# EAGLE schematic LinuxBoard_v1.91 (EAGLE 7.2.0)
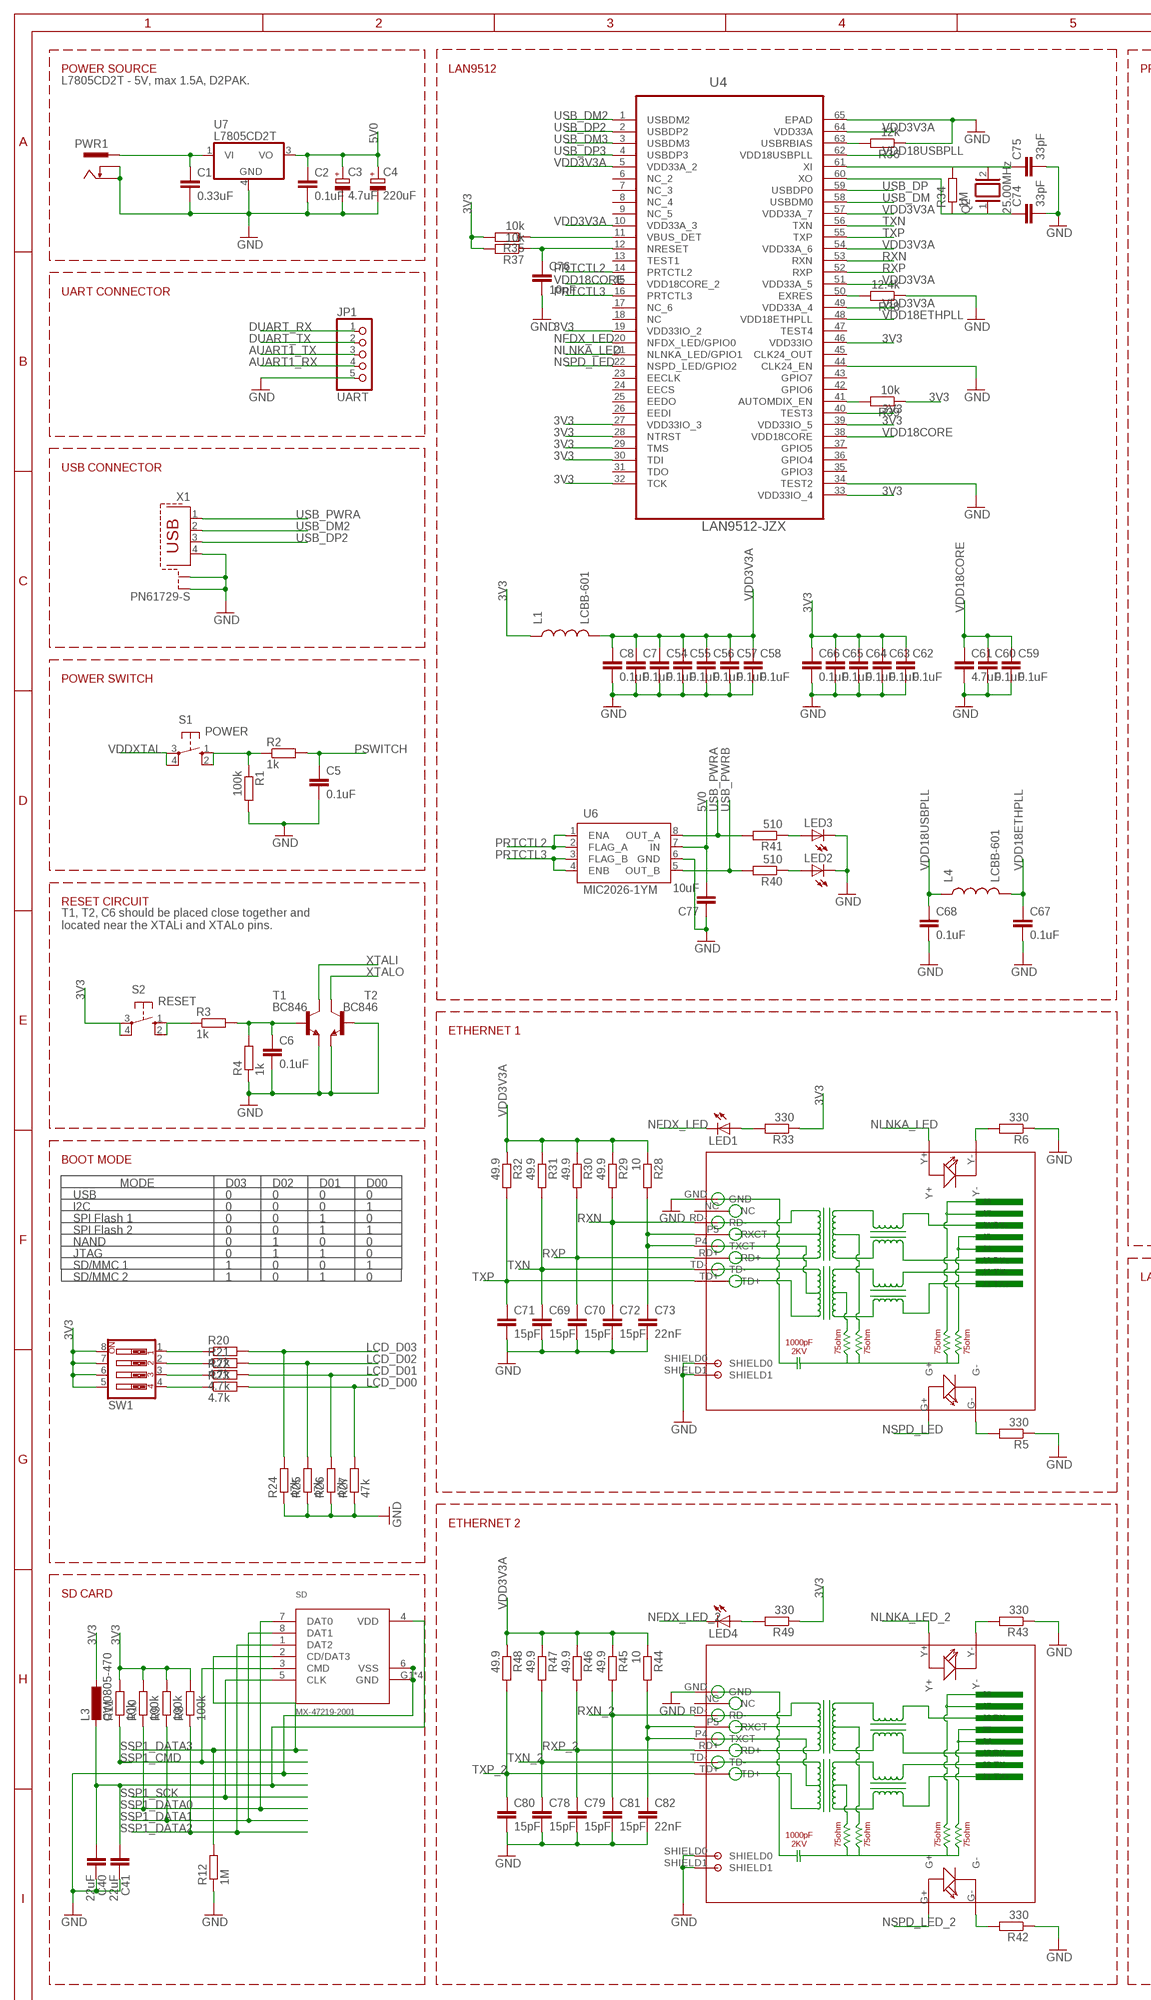
[diagram p0: schematic, sheet 1, part 1 of 2]
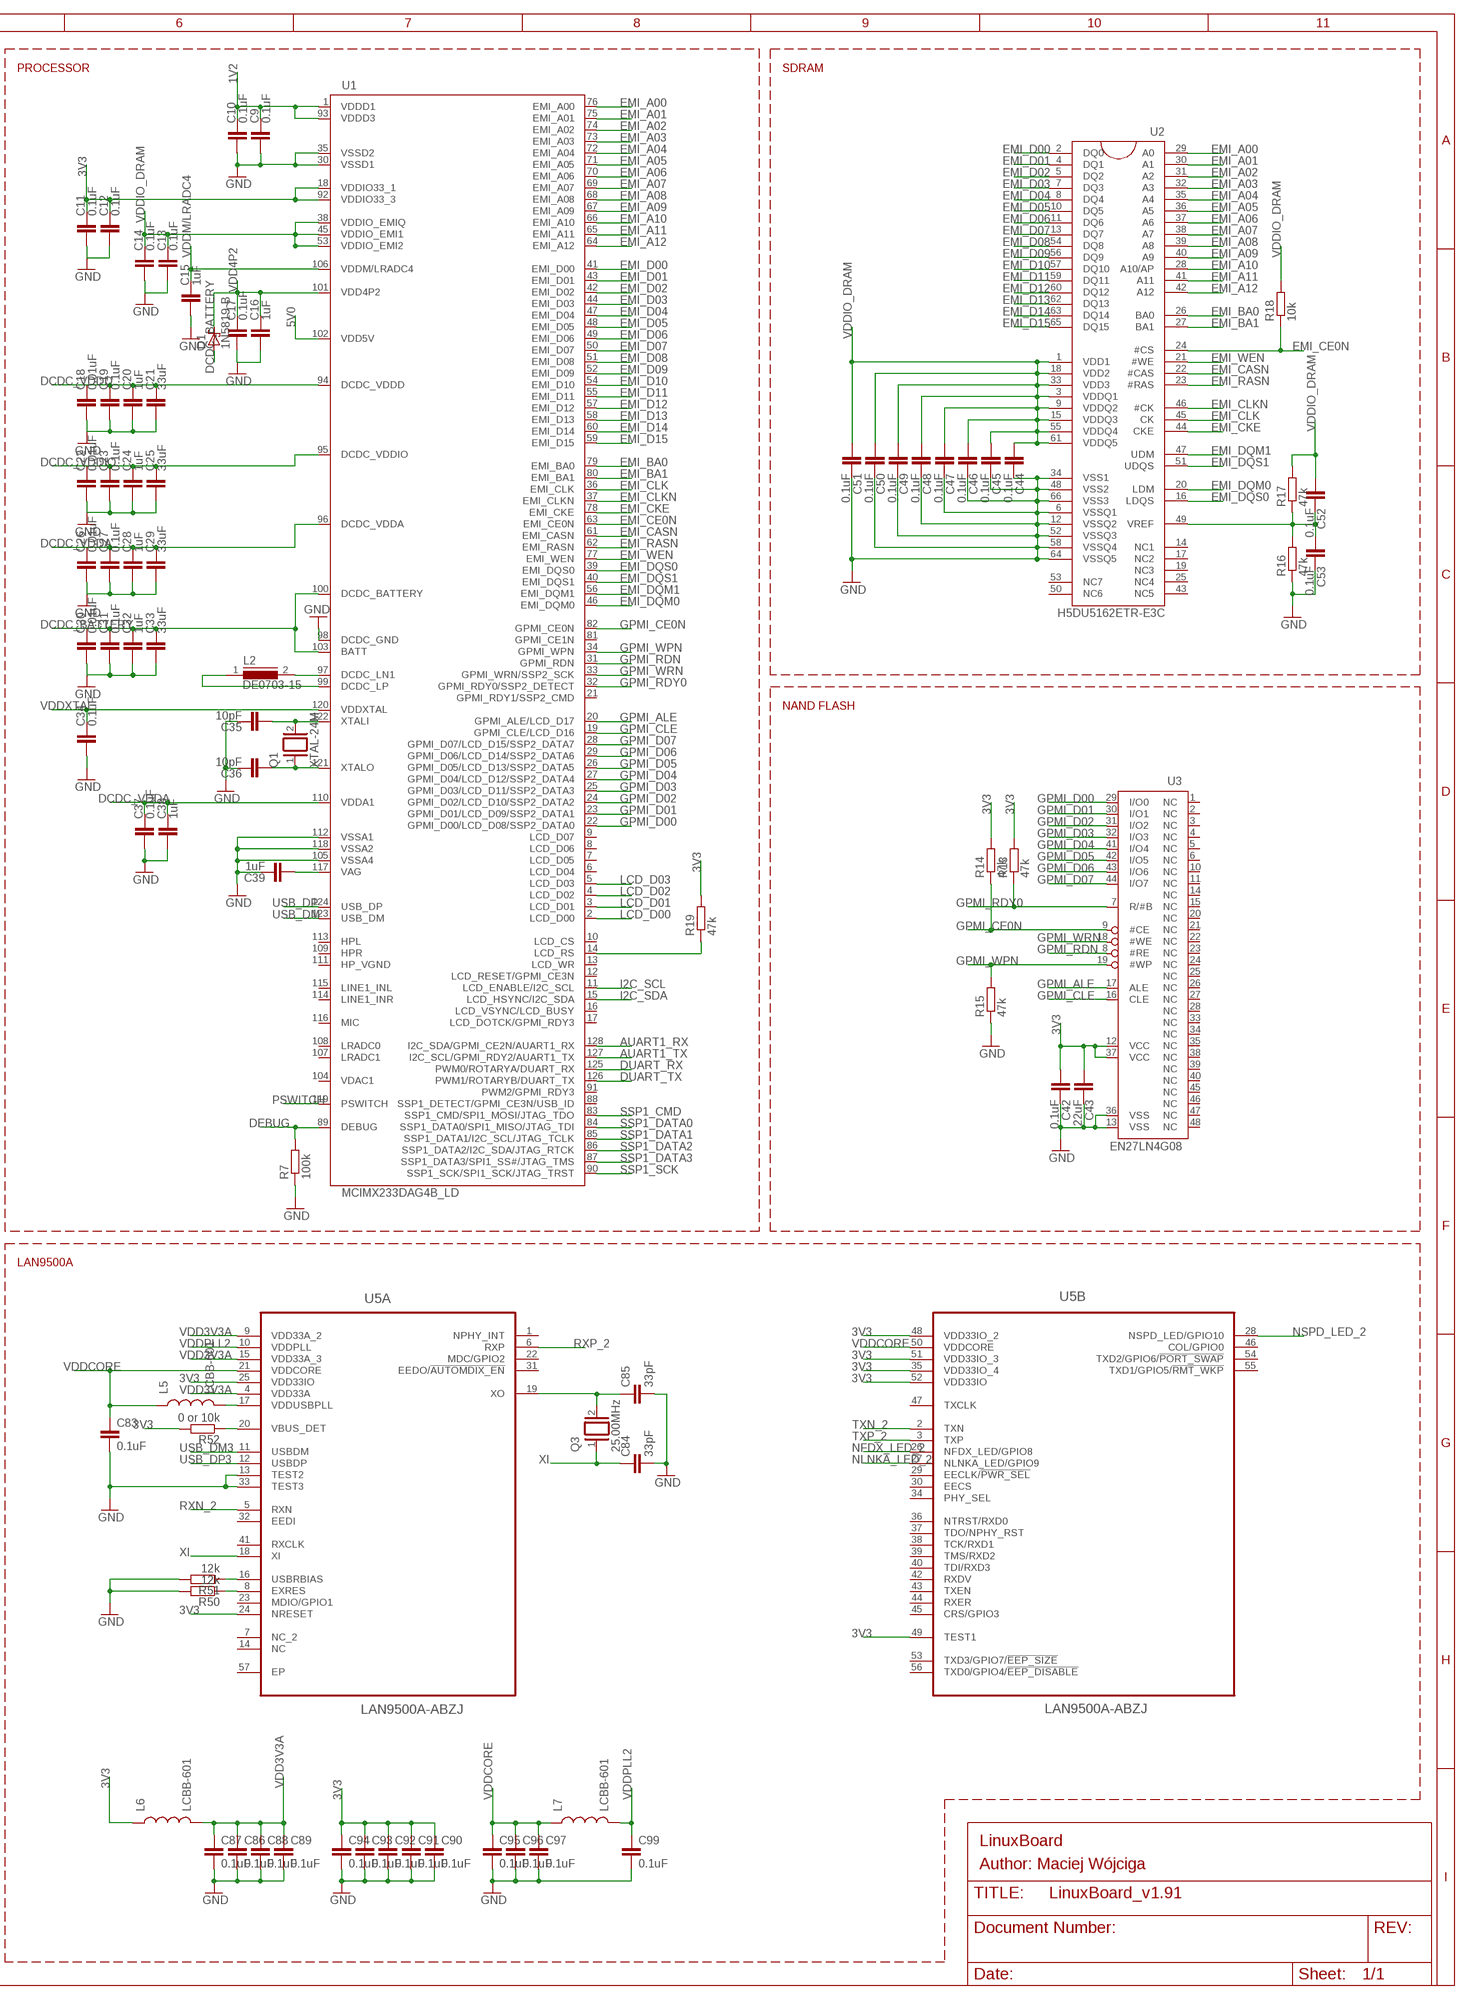
[diagram p1: schematic, sheet 1, part 2 of 2]

## Parts
C1  0.33uF  C-EUC0805  [C0805]
C2  0.1uF  C-EUC0805  [C0805]
C3  4.7uF  CPOL-EUE2-5  [E2-5]
C4  220uF  CPOL-EUE2-5  [E2-5]
C5  0.1uF  C-EUC0805  [C0805]
C6  0.1uF  C-EUC0805  [C0805]
C7  0.1uF  C-EUC0805  [C0805]
C8  0.1uF  C-EUC0805  [C0805]
C9  0.1uF  C-EUC0805  [C0805]
C10  0.1uF  C-EUC0805  [C0805]
C11  0.1uF  C-EUC0805  [C0805]
C12  0.1uF  C-EUC0805  [C0805]
C13  0.1uF  C-EUC0805  [C0805]
C14  0.1uF  C-EUC0805  [C0805]
C15  1uF  C-EUC0805  [C0805]
C16  1uF  C-EUC0805  [C0805]
C17  0.1uF  C-EUC0805  [C0805]
C18  0.01uF  C-EUC0805  [C0805]
C19  0.1uF  C-EUC0805  [C0805]
C20  1uF  C-EUC0805  [C0805]
C21  33uF  C-EUC0805  [C0805]
C22  0.01uF  C-EUC0805  [C0805]
C23  0.1uF  C-EUC0805  [C0805]
C24  1uF  C-EUC0805  [C0805]
C25  33uF  C-EUC0805  [C0805]
C26  0.01uF  C-EUC0805  [C0805]
C27  0.1uF  C-EUC0805  [C0805]
C28  1uF  C-EUC0805  [C0805]
C29  33uF  C-EUC0805  [C0805]
C30  0.01uF  C-EUC0805  [C0805]
C31  0.1uF  C-EUC0805  [C0805]
C32  1uF  C-EUC0805  [C0805]
C33  33uF  C-EUC0805  [C0805]
C34  0.1uF  C-EUC0805  [C0805]
C35  10pF  C-EUC0805  [C0805]
C36  10pF  C-EUC0805  [C0805]
C37  0.1uF  C-EUC0805  [C0805]
C38  1uF  C-EUC0805  [C0805]
C39  1uF  C-EUC0805  [C0805]
C40  22uF  C-EUC0805  [C0805]
C41  22uF  C-EUC0805  [C0805]
C42  0.1uF  C-EUC0805  [C0805]
C43  22uF  C-EUC0805  [C0805]
C44  0.1uF  C-EUC0805  [C0805]
C45  0.1uF  C-EUC0805  [C0805]
C46  0.1uF  C-EUC0805  [C0805]
C47  0.1uF  C-EUC0805  [C0805]
C48  0.1uF  C-EUC0805  [C0805]
C49  0.1uF  C-EUC0805  [C0805]
C50  0.1uF  C-EUC0805  [C0805]
C51  0.1uF  C-EUC0805  [C0805]
C52  0.1uF  C-EUC0805  [C0805]
C53  0.1uF  C-EUC0805  [C0805]
C54  0.1uF  C-EUC0805  [C0805]
C55  0.1uF  C-EUC0805  [C0805]
C56  0.1uF  C-EUC0805  [C0805]
C57  0.1uF  C-EUC0805  [C0805]
C58  0.1uF  C-EUC0805  [C0805]
C59  0.1uF  C-EUC0805  [C0805]
C60  0.1uF  C-EUC0805  [C0805]
C61  4.7uF  C-EUC0805  [C0805]
C62  0.1uF  C-EUC0805  [C0805]
C63  0.1uF  C-EUC0805  [C0805]
C64  0.1uF  C-EUC0805  [C0805]
C65  0.1uF  C-EUC0805  [C0805]
C66  0.1uF  C-EUC0805  [C0805]
C67  0.1uF  C-EUC0805  [C0805]
C68  0.1uF  C-EUC0805  [C0805]
C69  15pF  C-EUC0805  [C0805]
C70  15pF  C-EUC0805  [C0805]
C71  15pF  C-EUC0805  [C0805]
C72  15pF  C-EUC0805  [C0805]
C73  22nF  C-EUC0805  [C0805]
C74  33pF  C-EUC0805  [C0805]
C75  33pF  C-EUC0805  [C0805]
C76  10nF  C-EUC0805  [C0805]
C77  10uF  C-EUC0805  [C0805]
C78  15pF  C-EUC0805  [C0805]
C79  15pF  C-EUC0805  [C0805]
C80  15pF  C-EUC0805  [C0805]
C81  15pF  C-EUC0805  [C0805]
C82  22nF  C-EUC0805  [C0805]
C83  0.1uF  C-EUC0805  [C0805]
C84  33pF  C-EUC0805  [C0805]
C85  33pF  C-EUC0805  [C0805]
C86  0.1uF  C-EUC0805  [C0805]
C87  0.1uF  C-EUC0805  [C0805]
C88  0.1uF  C-EUC0805  [C0805]
C89  0.1uF  C-EUC0805  [C0805]
C90  0.1uF  C-EUC0805  [C0805]
C91  0.1uF  C-EUC0805  [C0805]
C92  0.1uF  C-EUC0805  [C0805]
C93  0.1uF  C-EUC0805  [C0805]
C94  0.1uF  C-EUC0805  [C0805]
C95  0.1uF  C-EUC0805  [C0805]
C96  0.1uF  C-EUC0805  [C0805]
C97  0.1uF  C-EUC0805  [C0805]
C99  0.1uF  C-EUC0805  [C0805]
D1  1N5819-B  [DO41-7.6]
JP1  UART  PINHD-1X5  [1X05]
L1  LCBB-601  INDUCTOR0805  [0805]
L2  DE0703-15  DR73  [DR73]
L3  CW0805-470  L-EUL2012C  [L2012C]
L4  LCBB-601  INDUCTOR0805  [0805]
L5  LCBB-601  INDUCTOR0805  [0805]
L6  LCBB-601  INDUCTOR0805  [0805]
L7  LCBB-601  INDUCTOR0805  [0805]
LED1  LEDSML0805  [SML0805]
LED2  LEDSML0805  [SML0805]
LED3  LEDSML0805  [SML0805]
LED4  LEDSML0805  [SML0805]
PWR1  PWR-JAKPWR_JACK_UNI_MILLING  [PWR_JACK_UNI_MILLING]
Q1  XTAL-24M  XTAL/S  [QS]
Q2  25.00MHz  XTAL/S  [QS]
Q3  25.00MHz  XTAL/S  [QS]
R1  100k  R-EU_R0805  [R0805]
R2  1k  R-EU_R0805  [R0805]
R3  1k  R-EU_R0805  [R0805]
R4  1k  R-EU_R0805  [R0805]
R5  330  R-EU_R0805  [R0805]
R6  330  R-EU_R0805  [R0805]
R7  100k  R-EU_R0805  [R0805]
R8  100k  R-EU_R0805  [R0805]
R9  100k  R-EU_R0805  [R0805]
R10  100k  R-EU_R0805  [R0805]
R11  10k  R-EU_R0805  [R0805]
R12  1M  R-EU_R0805  [R0805]
R13  47k  R-EU_R0805  [R0805]
R14  47k  R-EU_R0805  [R0805]
R15  47k  R-EU_R0805  [R0805]
R16  47k  R-EU_R0805  [R0805]
R17  47k  R-EU_R0805  [R0805]
R18  10k  R-EU_R0805  [R0805]
R19  47k  R-EU_R0805  [R0805]
R20  4.7k  R-EU_R0805  [R0805]
R21  4.7k  R-EU_R0805  [R0805]
R22  4.7k  R-EU_R0805  [R0805]
R23  4.7k  R-EU_R0805  [R0805]
R24  47k  R-EU_R0805  [R0805]
R25  47k  R-EU_R0805  [R0805]
R26  47k  R-EU_R0805  [R0805]
R27  47k  R-EU_R0805  [R0805]
R28  10  R-EU_R0805  [R0805]
R29  49.9  R-EU_R0805  [R0805]
R30  49.9  R-EU_R0805  [R0805]
R31  49.9  R-EU_R0805  [R0805]
R32  49.9  R-EU_R0805  [R0805]
R33  330  R-EU_R0805  [R0805]
R34  1M  R-EU_R0805  [R0805]
R35  10k  R-EU_R0805  [R0805]
R36  12k  R-EU_R0805  [R0805]
R37  10k  R-EU_R0805  [R0805]
R38  12.4k  R-EU_R0805  [R0805]
R39  10k  R-EU_R0805  [R0805]
R40  510  R-EU_R0805  [R0805]
R41  510  R-EU_R0805  [R0805]
R42  330  R-EU_R0805  [R0805]
R43  330  R-EU_R0805  [R0805]
R44  10  R-EU_R0805  [R0805]
R45  49.9  R-EU_R0805  [R0805]
R46  49.9  R-EU_R0805  [R0805]
R47  49.9  R-EU_R0805  [R0805]
R48  49.9  R-EU_R0805  [R0805]
R49  330  R-EU_R0805  [R0805]
R50  12k  R-EU_R0805  [R0805]
R51  12k  R-EU_R0805  [R0805]
R52  0 or 10k  R-EU_R0805  [R0805]
RJ1  HR911105A  [HR911105A]
RJ2  HR911105A  [HR911105A]
S1  POWER  10-XX  [B3F-10XX]
S2  RESET  10-XX  [B3F-10XX]
SD  MX-47219-2001  [MX-47219-2001]
SW1  SW_DIP-4  [EDG-04]
T1  BC846  [SOT23]
T2  BC846  [SOT23]
U1  MCIMX233DAG4B_LD  [TQFP128LD]
U2  H5DU5162ETR-E3C  HY5DU121622D(L)T(P)-J  [66TSOP-II]
U3  EN27LN4G08  H27UBG8T2A  [TSOP48]
U4  LAN9512-JZX  [QFN50P900X900X100-65N]
U5  LAN9500A-ABZJ  [QFN50P800X800X100-57N]
U6  MIC2026-1YM  [SO-8]
U7  L7805CD2T  [D2PAK-3]
X1  PN61729-S  [PN61729-S]

## Nets
1V2: C9.1 C10.1 U1.1(VDDD1) U1.93(VDDD3)
3V3: C11.1 C12.1 C42.2 C43.2 C62.1 C63.1 C64.1 C65.1 C66.1 C90.1 C91.1 C92.1 C93.1 C94.1 L1.1 L3.1 L6.1 R8.2 R9.2 R10.2 R11.2 R13.2 R14.2 R19.2 R33.1 R35.2 R37.2 R39.1 R49.1 R52.2 S2.3(P) S2.4(P1) SW1.5 SW1.6 SW1.7 SW1.8 U1.18(VDDIO33_1) U1.92(VDDIO33_3) U3.12(VCC) U3.37(VCC) U4.19(VDD33IO_2) U4.27(VDD33IO_3) U4.28(NTRST) U4.29(TMS) U4.30(TDI) U4.32(TCK) U4.33(VDD33IO_4) U4.39(VDD33IO_5) U4.40(TEST3) U4.46(VDD33IO) U5.24(A:NRESET) U5.25(A:VDD33IO) U5.35(B:VDD33IO_4) U5.48(B:VDD33IO_2) U5.49(B:TEST1) U5.51(B:VDD33IO_3) U5.52(B:VDD33IO)
5V0: C2.1 C3.+ C4.+ C77.2 U1.102(VDD5V) U6.7(IN) U7.3(VO)
AUART1_RX: JP1.4 U1.128(I2C_SDA/GPMI_CE2N/AUART1_RX)
AUART1_TX: JP1.3 U1.127(I2C_SCL/GPMI_RDY2/AUART1_TX)
DCDC_BATTERY: C30.1 C31.1 C32.1 C33.1 D1.A U1.100(DCDC_BATTERY) U1.103(BATT)
DCDC_VDDA: C26.1 C27.1 C28.1 C29.1 C37.1 C38.1 U1.96(DCDC_VDDA) U1.110(VDDA1)
DCDC_VDDD: C18.1 C19.1 C20.1 C21.1 U1.94(DCDC_VDDD)
DCDC_VDDIO: C22.1 C23.1 C24.1 C25.1 U1.95(DCDC_VDDIO)
DEBUG: R7.2 U1.89(DEBUG)
DUART_RX: JP1.1 U1.125(PWM0/ROTARYA/DUART_RX)
DUART_TX: JP1.2 U1.126(PWM1/ROTARYB/DUART_TX)
EMI_A00: U1.76(EMI_A00) U2.29(A0)
EMI_A01: U1.75(EMI_A01) U2.30(A1)
EMI_A02: U1.74(EMI_A02) U2.31(A2)
EMI_A03: U1.73(EMI_A03) U2.32(A3)
EMI_A04: U1.72(EMI_A04) U2.35(A4)
EMI_A05: U1.71(EMI_A05) U2.36(A5)
EMI_A06: U1.70(EMI_A06) U2.37(A6)
EMI_A07: U1.69(EMI_A07) U2.38(A7)
EMI_A08: U1.68(EMI_A08) U2.39(A8)
EMI_A09: U1.67(EMI_A09) U2.40(A9)
EMI_A10: U1.66(EMI_A10) U2.28(A10/AP)
EMI_A11: U1.65(EMI_A11) U2.41(A11)
EMI_A12: U1.64(EMI_A12) U2.42(A12)
EMI_BA0: U1.79(EMI_BA0) U2.26(BA0)
EMI_BA1: U1.80(EMI_BA1) U2.27(BA1)
EMI_CASN: U1.61(EMI_CASN) U2.22(#CAS)
EMI_CE0N: R18.1 U1.63(EMI_CE0N) U2.24(#CS)
EMI_CKE: U1.78(EMI_CKE) U2.44(CKE)
EMI_CLK: U1.36(EMI_CLK) U2.45(CK)
EMI_CLKN: U1.37(EMI_CLKN) U2.46(#CK)
EMI_D00: U1.41(EMI_D00) U2.2(DQ0)
EMI_D01: U1.43(EMI_D01) U2.4(DQ1)
EMI_D02: U1.42(EMI_D02) U2.5(DQ2)
EMI_D03: U1.44(EMI_D03) U2.7(DQ3)
EMI_D04: U1.47(EMI_D04) U2.8(DQ4)
EMI_D05: U1.48(EMI_D05) U2.10(DQ5)
EMI_D06: U1.49(EMI_D06) U2.11(DQ6)
EMI_D07: U1.50(EMI_D07) U2.13(DQ7)
EMI_D08: U1.51(EMI_D08) U2.54(DQ8)
EMI_D09: U1.52(EMI_D09) U2.56(DQ9)
EMI_D10: U1.54(EMI_D10) U2.57(DQ10)
EMI_D11: U1.55(EMI_D11) U2.59(DQ11)
EMI_D12: U1.57(EMI_D12) U2.60(DQ12)
EMI_D13: U1.58(EMI_D13) U2.62(DQ13)
EMI_D14: U1.60(EMI_D14) U2.63(DQ14)
EMI_D15: U1.59(EMI_D15) U2.65(DQ15)
EMI_DQM0: U1.46(EMI_DQM0) U2.20(LDM)
EMI_DQM1: U1.56(EMI_DQM1) U2.47(UDM)
EMI_DQS0: U1.39(EMI_DQS0) U2.16(LDQS)
EMI_DQS1: U1.40(EMI_DQS1) U2.51(UDQS)
EMI_RASN: U1.62(EMI_RASN) U2.23(#RAS)
EMI_WEN: U1.77(EMI_WEN) U2.21(#WE)
GND: C1.2 C2.2 C3.- C4.- C5.2 C6.2 C7.2 C8.2 C9.2 C10.2 C11.2 C12.2 C13.2 C14.2 C15.2 C16.2 C17.2 C18.2 C19.2 C20.2 C21.2 C22.2 C23.2 C24.2 C25.2 C26.2 C27.2 C28.2 C29.2 C30.2 C31.2 C32.2 C33.2 C34.2 C35.1 C36.1 C37.2 C38.2 C39.1 C40.1 C41.1 C42.1 C43.1 C44.1 C45.1 C46.1 C47.1 C48.1 C49.1 C50.1 C51.1 C53.1 C54.2 C55.2 C56.2 C57.2 C58.2 C59.2 C60.2 C61.2 C62.2 C63.2 C64.2 C65.2 C66.2 C67.2 C68.2 C69.2 C70.2 C71.2 C72.2 C73.2 C74.2 C75.2 C76.2 C77.1 C78.2 C79.2 C80.2 C81.2 C82.2 C83.2 C84.2 C85.2 C86.2 C87.2 C88.2 C89.2 C90.2 C91.2 C92.2 C93.2 C94.2 C95.2 C96.2 C97.2 C99.2 JP1.5 LED2.C LED3.C PWR1.- PWR1.-- R1.2 R4.1 R5.1 R6.1 R7.1 R12.1 R15.1 R16.1 R24.1 R25.1 R26.1 R27.1 R36.1 R38.1 R42.1 R43.1 R50.2 R51.2 RJ1.GND RJ1.SHIELD0 RJ1.SHIELD1 RJ2.GND RJ2.SHIELD0 RJ2.SHIELD1 SD.6(VSS) SD.G1(GND) SD.G2(GND) SD.G3(GND) SD.G4(GND) T1.2(E) T2.1(B) T2.2(E) U1.30(VSSD1) U1.35(VSSD2) U1.98(DCDC_GND) U1.105(VSSA4) U1.112(VSSA1) U1.118(VSSA2) U2.6(VSSQ1) U2.12(VSSQ2) U2.34(VSS1) U2.48(VSS2) U2.52(VSSQ3) U2.58(VSSQ4) U2.64(VSSQ5) U2.66(VSS3) U3.13(VSS) U3.36(VSS) U4.34(TEST2) U4.44(CLK24_EN) U4.65(EPAD) U5.13(A:TEST2) U5.33(A:TEST3) U6.6(GND) U7.4(GND) X1.4 X1.S1 X1.S2
GPMI_ALE: U1.20(GPMI_ALE/LCD_D17) U3.17(ALE)
GPMI_CE0N: R14.1 U1.82(GPMI_CE0N) U3.9(#CE)
GPMI_CLE: U1.19(GPMI_CLE/LCD_D16) U3.16(CLE)
GPMI_D00: U1.22(GPMI_D00/LCD_D08/SSP2_DATA0) U3.29(I/O0)
GPMI_D01: U1.23(GPMI_D01/LCD_D09/SSP2_DATA1) U3.30(I/O1)
GPMI_D02: U1.24(GPMI_D02/LCD_D10/SSP2_DATA2) U3.31(I/O2)
GPMI_D03: U1.25(GPMI_D03/LCD_D11/SSP2_DATA3) U3.32(I/O3)
GPMI_D04: U1.27(GPMI_D04/LCD_D12/SSP2_DATA4) U3.41(I/O4)
GPMI_D05: U1.26(GPMI_D05/LCD_D13/SSP2_DATA5) U3.42(I/O5)
GPMI_D06: U1.29(GPMI_D06/LCD_D14/SSP2_DATA6) U3.43(I/O6)
GPMI_D07: U1.28(GPMI_D07/LCD_D15/SSP2_DATA7) U3.44(I/O7)
GPMI_RDN: U1.31(GPMI_RDN) U3.8(#RE)
GPMI_RDY0: R13.1 U1.32(GPMI_RDY0/SSP2_DETECT) U3.7(R/#B)
GPMI_WPN: R15.2 U1.34(GPMI_WPN) U3.19(#WP)
GPMI_WRN: U1.33(GPMI_WRN/SSP2_SCK) U3.18(#WE)
I2C_SCL: U1.11(LCD_ENABLE/I2C_SCL)
I2C_SDA: U1.15(LCD_HSYNC/I2C_SDA)
LCD_D00: R23.2 R27.2 U1.2(LCD_D00)
LCD_D01: R22.2 R26.2 U1.3(LCD_D01)
LCD_D02: R21.2 R25.2 U1.4(LCD_D02)
LCD_D03: R20.2 R24.2 U1.5(LCD_D03)
N$1: C1.1 PWR1.+ U7.1(VI)
N$2: R3.1 S2.1(S) S2.2(S1)
N$3: R1.1 R2.1 S1.1(S) S1.2(S1)
N$4: C6.1 R3.2 R4.2 T1.1(B)
N$5: R20.1 SW1.1
N$6: R21.1 SW1.2
N$7: R22.1 SW1.3
N$8: R23.1 SW1.4
N$9: L2.2 U1.97(DCDC_LN1)
N$10: R5.2 RJ1.G-
N$11: L2.1 U1.99(DCDC_LP)
N$12: C39.2 U1.117(VAG)
N$13: R19.1 U1.14(LCD_RS)
N$14: R6.2 RJ1.Y-
N$15: C75.1 Q2.2 R34.2 U4.61(XI)
N$16: C40.2 C41.2 L3.2 SD.4(VDD)
N$17: C73.1 R28.2 RJ1.P4(TXCT) RJ1.P5(RXCT)
N$18: LED1.A R33.2
N$19: C74.1 Q2.1 R34.1 U4.60(XO)
N$20: R35.1 U4.11(VBUS_DET)
N$21: R36.2 U4.63(USBRBIAS)
N$22: C76.1 R37.1 U4.12(NRESET)
N$23: R38.2 U4.50(EXRES)
N$24: R42.2 RJ2.G-
N$25: R39.2 U4.41(AUTOMDIX_EN)
N$26: C52.1 C53.2 R16.2 R17.1 U2.49(VREF)
N$27: R43.2 RJ2.Y-
N$28: LED3.A R41.1
N$29: LED2.A R40.1
N$30: C82.1 R44.2 RJ2.P4(TXCT) RJ2.P5(RXCT)
N$31: LED4.A R49.2
N$32: L5.2 U5.17(A:VDDUSBPLL)
N$33: C85.1 Q3.2 U5.19(A:XO)
N$34: R51.1 U5.16(A:USBRBIAS)
N$35: R50.1 U5.8(A:EXRES)
N$36: R52.1 U5.20(A:VBUS_DET)
NFDX_LED: LED1.C U4.20(NFDX_LED/GPIO0)
NFDX_LED_2: LED4.C U5.26(B:NFDX_LED/GPIO8)
NLNKA_LED: RJ1.Y+ U4.21(NLNKA_LED/GPIO1)
NLNKA_LED_2: RJ2.Y+ U5.27(B:NLNKA_LED/GPIO9)
NSPD_LED: RJ1.G+ U4.22(NSPD_LED/GPIO2)
NSPD_LED_2: RJ2.G+ U5.28(B:NSPD_LED/GPIO10)
PRTCTL2: U4.14(PRTCTL2) U6.1(ENA) U6.2(FLAG_A)
PRTCTL3: U4.16(PRTCTL3) U6.3(FLAG_B) U6.4(ENB)
PSWITCH: C5.1 R2.2 U1.119(PSWITCH)
RXN: C72.1 R29.2 RJ1.RD- U4.53(RXN)
RXN_2: C81.1 R45.2 RJ2.RD- U5.5(A:RXN)
RXP: C70.1 R30.2 RJ1.RD+ U4.52(RXP)
RXP_2: C79.1 R46.2 RJ2.RD+ U5.6(A:RXP)
SSP1_CMD: R11.1 SD.3(CMD) U1.83(SSP1_CMD/SPI1_MOSI/JTAG_TDO)
SSP1_DATA0: R10.1 SD.7(DAT0) U1.84(SSP1_DATA0/SPI1_MISO/JTAG_TDI)
SSP1_DATA1: R9.1 SD.8(DAT1) U1.85(SSP1_DATA1/I2C_SCL/JTAG_TCLK)
SSP1_DATA2: R8.1 SD.1(DAT2) U1.86(SSP1_DATA2/I2C_SDA/JTAG_RTCK)
SSP1_DATA3: R12.2 SD.2(CD/DAT3) U1.87(SSP1_DATA3/SPI1_SS#/JTAG_TMS)
SSP1_SCK: SD.5(CLK) U1.90(SSP1_SCK/SPI1_SCK/JTAG_TRST)
TXN: C69.1 R31.2 RJ1.TD- U4.56(TXN)
TXN_2: C78.1 R47.2 RJ2.TD- U5.2(B:TXN)
TXP: C71.1 R32.2 RJ1.TD+ U4.55(TXP)
TXP_2: C80.1 R48.2 RJ2.TD+ U5.3(B:TXP)
USB_DM: U1.123(USB_DM) U4.58(USBDM0)
USB_DM2: U4.1(USBDM2) X1.2
USB_DM3: U4.3(USBDM3) U5.11(A:USBDM)
USB_DP: U1.124(USB_DP) U4.59(USBDP0)
USB_DP2: U4.2(USBDP2) X1.3
USB_DP3: U4.4(USBDP3) U5.12(A:USBDP)
USB_PWRA: R41.2 U6.8(OUT_A) X1.1
USB_PWRB: R40.2 U6.5(OUT_B)
VDD3V3A: C7.1 C8.1 C54.1 C55.1 C56.1 C57.1 C58.1 C86.1 C87.1 C88.1 C89.1 L1.2 L6.2 R28.1 R29.1 R30.1 R31.1 R32.1 R44.1 R45.1 R46.1 R47.1 R48.1 U4.5(VDD33A_2) U4.10(VDD33A_3) U4.49(VDD33A_4) U4.51(VDD33A_5) U4.54(VDD33A_6) U4.57(VDD33A_7) U4.64(VDD33A) U5.4(A:VDD33A) U5.9(A:VDD33A_2) U5.15(A:VDD33A_3)
VDD4P2: C16.1 C17.1 D1.C U1.101(VDD4P2)
VDD18CORE: C59.1 C60.1 C61.1 U4.15(VDD18CORE_2) U4.38(VDD18CORE)
VDD18ETHPLL: C67.1 L4.2 U4.48(VDD18ETHPLL)
VDD18USBPLL: C68.1 L4.1 U4.62(VDD18USBPLL)
VDDCORE: C83.1 C95.1 C96.1 C97.1 L5.1 L7.1 U5.21(A:VDDCORE) U5.50(B:VDDCORE)
VDDIO_DRAM: C13.1 C14.1 C44.2 C45.2 C46.2 C47.2 C48.2 C49.2 C50.2 C51.2 C52.2 R17.2 R18.2 U1.38(VDDIO_EMIQ) U1.45(VDDIO_EMI1) U1.53(VDDIO_EMI2) U2.1(VDD1) U2.3(VDDQ1) U2.9(VDDQ2) U2.15(VDDQ3) U2.18(VDD2) U2.33(VDD3) U2.55(VDDQ4) U2.61(VDDQ5)
VDDM/LRADC4: C15.1 U1.106(VDDM/LRADC4)
VDDPLL2: C99.1 L7.2 U5.10(A:VDDPLL)
VDDXTAL: C34.1 S1.3(P) S1.4(P1) U1.120(VDDXTAL)
XI: C84.1 Q3.1 U5.18(A:XI)
XTALI: C35.2 Q1.2 T1.3(C) U1.122(XTALI)
XTALO: C36.2 Q1.1 T2.3(C) U1.121(XTALO)
Unconnected: RJ1.NC RJ2.NC U1.6(LCD_D04) U1.7(LCD_D05) U1.8(LCD_D06) U1.9(LCD_D07) U1.10(LCD_CS) U1.12(LCD_RESET/GPMI_CE3N) U1.13(LCD_WR) U1.16(LCD_VSYNC/LCD_BUSY) U1.17(LCD_DOTCK/GPMI_RDY3) U1.21(GPMI_RDY1/SSP2_CMD) U1.81(GPMI_CE1N) U1.88(SSP1_DETECT/GPMI_CE3N/USB_ID) U1.91(PWM2/GPMI_RDY3) U1.104(VDAC1) U1.107(LRADC1) U1.108(LRADC0) U1.109(HPR) U1.113(HPL) U1.114(LINE1_INR) U1.115(LINE1_INL) U1.116(MIC) U2.14(NC1) U2.17(NC2) U2.19(NC3) U2.25(NC4) U2.43(NC5) U2.50(NC6) U2.53(NC7) U3.1(NC) U3.2(NC) U3.3(NC) U3.4(NC) U3.5(NC) U3.6(NC) U3.10(NC) U3.11(NC) U3.14(NC) U3.15(NC) U3.20(NC) U3.21(NC) U3.22(NC) U3.23(NC) U3.24(NC) U3.25(NC) U3.26(NC) U3.27(NC) U3.28(NC) U3.33(NC) U3.34(NC) U3.35(NC) U3.38(NC) U3.39(NC) U3.40(NC) U3.45(NC) U3.46(NC) U3.47(NC) U3.48(NC) U4.6(NC_2) U4.7(NC_3) U4.8(NC_4) U4.9(NC_5) U4.13(TEST1) U4.17(NC_6) U4.18(NC) U4.23(EECLK) U4.24(EECS) U4.25(EEDO) U4.26(EEDI) U4.31(TDO) U4.35(GPIO3) U4.36(GPIO4) U4.37(GPIO5) U4.42(GPIO6) U4.43(GPIO7) U4.45(CLK24_OUT) U4.47(TEST4) U5.1(A:NPHY_INT) U5.7(A:NC_2) U5.14(A:NC) U5.22(A:MDC/GPIO2) U5.23(A:MDIO/GPIO1) U5.29(B:EECLK/!PWR_SEL) U5.30(B:EECS) U5.31(A:EEDO/!AUTOMDIX_EN) U5.32(A:EEDI) U5.34(B:PHY_SEL) U5.36(B:NTRST/RXD0) U5.37(B:TDO/NPHY_RST) U5.38(B:TCK/RXD1) U5.39(B:TMS/RXD2) U5.40(B:TDI/RXD3) U5.41(A:RXCLK) U5.42(B:RXDV) U5.43(B:TXEN) U5.44(B:RXER) U5.45(B:CRS/GPIO3) U5.46(B:COL/GPIO0) U5.47(B:TXCLK) U5.53(B:TXD3/GPIO7/!EEP_SIZE) U5.54(B:TXD2/GPIO6/!PORT_SWAP) U5.55(B:TXD1/GPIO5/!RMT_WKP) U5.56(B:TXD0/GPIO4/!EEP_DISABLE) U5.57(A:EP)

## Notes on the sheet
- POWER SOURCE | LAN9512 | PROCESSOR | SDRAM
- L7805CD2T - 5V, max 1.5A, D2PAK.
- UART CONNECTOR
- USB CONNECTOR
- POWER SWITCH
- NAND FLASH
- RESET CIRCUIT
- T1, T2, C6 should be placed close together and
  located near the XTALi and XTALo pins.
- ETHERNET 1
- BOOT MODE
- MODE | D03 | D02 | D01 | D00
- USB | 0 | 0 | 0 | 0
- I2C | 0 | 0 | 0 | 1
- SPI Flash 1 | 0 | 0 | 1 | 0
- SPI Flash 2 | 0 | 0 | 1 | 1
- NAND | 0 | 1 | 0 | 0
- JTAG | 0 | 1 | 1 | 0
- SD/MMC 1 | 1 | 0 | 0 | 1
- SD/MMC 2 | 1 | 0 | 1 | 0 | LAN9500A
- ETHERNET 2
- SD CARD
- LinuxBoard
- Author: Maciej Wójciga

## Power pins joined to a net without a drawn wire
HP_VGND: U1.111(HP_VGND)

## Library data of the parts
C1 C2 C5-C97 C99 = rcl:C-EU: CAPACITOR, European symbol
C3 C4 = rcl:CPOL-EU: POLARIZED CAPACITOR, European symbol
D1 = diode:1N581*: 1.0A SCHOTTKY BARRIER RECTIFIER Source: http://www.diodes.com/datasheets/ds23001.pdf
JP1 = pinhead:PINHD-1X5: PIN HEADER
L1 L4-L7 = SparkFun-Passives:INDUCTOR: Inductors Basic Inductor/Choke - 0603 and 1206. Footprints are not proven and vary greatly between part numbers. SRN6045- 33uH, 20% 1.4A SDR0403-560KL - 56uH, 10%, 500mA RMS/740mA peak
L2 = inductors:DR73: High Power Density, High Efficiency, Shielded Inductors Source: coiltronics_dr_series.pdf
L3 = rcl:L-EU: INDUCTOR, European symbol
LED1-LED4 = led:LED: LED OSRAM: - CHIPLED LG R971, LG N971, LY N971, LG Q971, LY Q971, LO R971, LY R971 LH N974, LH R974 LS Q976, LO Q976, LY Q976 LO Q996 - Hyper CHIPLED LW Q18S LB Q993, LB Q99A, LB R99A - SideLED LS A670, LO A670, LY A670, LG A670, LP A670 LB A673, LV A673, LT A673, LW A673 LH A674 LY A675 LS A676, LA A676, LO A676, LY A676, LW A676 LS A679, LY A679, LG A679 - Hyper Micro SIDELED® LS Y876, LA Y876, LO Y876, LY Y876 LT Y87S - SmartLED LW L88C, LW L88S LB L89C, LB L89S, LG L890 LS L89K, LO L89K, LY L89K LS L896, LA L896, LO L896, LY L896 - TOPLED LS T670, LO T670, LY T670, LG T670, LP T670 LSG T670, LSP T670, LSY T670, LOP T670, LYG T670 LG T671, LOG T671, LSG T671 LB T673, LV T673, LT T673, LW T673 LH T674 LS T676, LA T676, LO T676, LY T676, LB T676, LH T676, LSB T676, LW T676 LB T67C, LV T67C, LT T67C, LS T67K, LO T67K, LY T67K, LW E67C LS E67B, LA E67B, LO E67B, LY E67B, LB E67C, LV E67C, LT E67C LW T67C LS T679, LY T679, LG T679 LS T770, LO T770, LY T770, LG T770, LP T770 LB T773, LV T773, LT T773, LW T773 LH T774 LS E675, LA E675, LY E675, LS T675 LS T776, LA T776, LO T776, LY T776, LB T776 LHGB T686 LT T68C, LB T68C - Hyper Mini TOPLED® LB M676 - Mini TOPLED Santana® LG M470 LS M47K, LO M47K, LY M47K Source: http://www.osram.convergy.de LUXEON: - LUMILED® LXK2-PW12-R00, LXK2-PW12-S00, LXK2-PW14-U00, LXK2-PW14-V00 LXK2-PM12-R00, LXK2-PM12-S00, LXK2-PM14-U00 LXK2-PE12-Q00, LXK2-PE12-R00, LXK2-PE12-S00, LXK2-PE14-T00, LXK2-PE14-U00 LXK2-PB12-K00, LXK2-PB12-L00, LXK2-PB12-M00, LXK2-PB14-N00, LXK2-PB14-P00, LXK2-PB14-Q00 LXK2-PR12-L00, LXK2-PR12-M00, LXK2-PR14-Q00, LXK2-PR14-R00 LXK2-PD12-Q00, LXK2-PD12-R00, LXK2-PD12-S00 LXK2-PH12-R00, LXK2-PH12-S00 LXK2-PL12-P00, LXK2-PL12-Q00, LXK2-PL12-R00 Source: www.luxeon.com KINGBRIGHT: KA-3528ASYC Source: www.kingbright.com
PWR1 = iMX233-OLINUXINO-MAXI_Rev_D:PWR-JAK
Q1-Q3 = special:XTAL/S: CRYSTAL
R1-R52 = rcl:R-EU_: RESISTOR, European symbol
RJ1 RJ2 = CONNECTER:HR911105A
S1 S2 = switch-omron:10-XX: OMRON SWITCH; MPN: B3F-1000; OC_FARNELL: 176432; OC_NEWARK: 36M3542
SD = hosho:MX-47219-2001
SW1 = special:SW_DIP-4: DIP SWITCH
T1 T2 = transistor:BC846: NPN TRANSISTOR
U1 = hosho:MCIMX233DAG4B: i.MX23
U2 = iMX233-OLinuXino-Micro_Rev_D:HY5DU121622D(L)T(P)
U3 = A13-OLinuXino_WIFI_Rev_G:H27UBG8T2A
U4 = hosho:LAN9512-JZX: IC, USB2 - ENET CNTRL 2-PORT HUB, 64VQFN; MPN: LAN9512-JZX; OC_FARNELL: 2292586; OC_NEWARK: 66W1988; PACKAGE: 64VQFN; SUPPLIER: Microchip
U5 = hosho:LAN9500A-ABZJ: Ethernet Controller,56VQFN; MPN: LAN9500A-ABZJ; OC_FARNELL: 2292585; OC_NEWARK: 66W1987; PACKAGE: 56VQFN; SUPPLIER: MICROCHIP
U6 = iMX233-OLINUXINO-MAXI_Rev_D:MIC2026: LM3526 Dual Port USB Power Switch and Over-Current Protection Features: -> Compatible with USB1.1 and USB2.0; -> 1 ms fault flag delay filters Hot-Plug events; -> Smooth turn-on eliminates in-rush induced voltage drop; -> UL recognized component: REF#205202; -> 1A nominal shortcircuit output current protects PC power supplies; -> Thermal shutdown protects device in direct short condition; -> 500mA minimum continuous load current; -> Small SO-8 package minimizes board space; -> 2.7V to 5.5V input voltage range; -> 140mOhm Max.switch resistance; -> 1 µA Max. standby current; -> 200µA Max. operating current; -> Under-voltage lockout(UVLO);
U7 = hosho:L7805CD2T
X1 = con-berg:PN61729-S: BERG USB connector; OC_FARNELL: unknown; OC_NEWARK: unknown

## Net classes
1 pwr: width 0.5 mm, clearance 0.2 mm